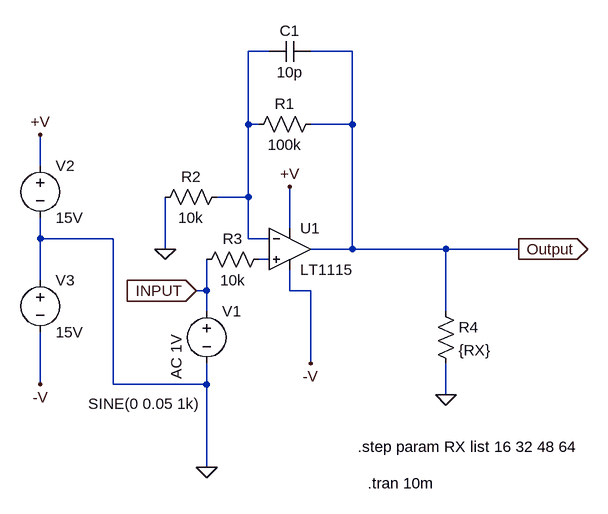
[diagram p0: schematic 25.1_11.(1).asc]
25.1_11.(1).asc, the LTspice schematic file:
Version 4
SHEET 1 880 680
WIRE 192 -112 160 -112
WIRE 320 -112 256 -112
WIRE 160 0 160 -112
WIRE 176 0 160 0
WIRE 320 0 320 -112
WIRE 320 0 256 0
WIRE -160 64 -160 16
WIRE 160 112 160 0
WIRE 160 112 112 112
WIRE 224 160 224 96
WIRE -160 176 -160 144
WIRE -48 176 -160 176
WIRE 160 176 160 112
WIRE 192 176 160 176
WIRE 32 192 32 112
WIRE 320 192 320 0
WIRE 320 192 256 192
WIRE 464 192 320 192
WIRE 576 192 464 192
WIRE 192 208 176 208
WIRE -160 240 -160 176
WIRE 96 256 96 208
WIRE 96 256 80 256
WIRE 224 256 224 224
WIRE 256 256 224 256
WIRE 96 288 96 256
WIRE 464 288 464 192
WIRE 256 368 256 256
WIRE -160 400 -160 320
WIRE -48 400 -48 176
WIRE 96 400 96 368
WIRE 96 400 -48 400
WIRE 464 416 464 368
WIRE 96 528 96 400
FLAG 576 192 Output
IOPIN 576 192 Out
FLAG 96 528 0
FLAG -160 16 +V
FLAG 224 96 +V
FLAG -160 400 -V
FLAG 256 368 -V
FLAG 80 256 INPUT
IOPIN 80 256 In
FLAG 464 416 0
FLAG 32 192 0
SYMBOL voltage -160 48 R0
WINDOW 123 0 0 Left 2
WINDOW 39 0 0 Left 2
SYMATTR InstName V2
SYMATTR Value 15V
SYMBOL voltage -160 224 R0
WINDOW 123 0 0 Left 2
WINDOW 39 0 0 Left 2
SYMATTR InstName V3
SYMATTR Value 15V
SYMBOL voltage 96 272 R0
WINDOW 123 -47 121 VLeft 2
WINDOW 39 0 0 Left 2
WINDOW 3 -182 158 Left 2
SYMATTR Value2 AC 1V
SYMATTR Value SINE(0 0.05 1k)
SYMATTR InstName V1
SYMBOL res 128 96 R90
WINDOW 0 0 56 VBottom 2
WINDOW 3 32 56 VTop 2
SYMATTR InstName R2
SYMATTR Value 10k
SYMBOL res 192 192 R90
WINDOW 0 0 56 VBottom 2
WINDOW 3 32 56 VTop 2
SYMATTR InstName R3
SYMATTR Value 10k
SYMBOL res 272 -16 R90
WINDOW 0 0 56 VBottom 2
WINDOW 3 32 56 VTop 2
SYMATTR InstName R1
SYMATTR Value 100k
SYMBOL res 448 272 R0
SYMATTR InstName R4
SYMATTR Value {RX}
SYMBOL Opamps\\LT1115 224 128 R0
SYMATTR InstName U1
SYMBOL cap 256 -128 R90
WINDOW 0 0 32 VBottom 2
WINDOW 3 32 32 VTop 2
SYMATTR InstName C1
SYMATTR Value 10p
TEXT 328 496 Left 2 !.step param RX list 16 32 48 64
TEXT 344 552 Left 2 !.tran 10m

The netlist it stands for:
* 25.1_11.(1).asc
V2 +V 0 15V
V3 0 -V 15V
V1 INPUT 0 SINE(0 0.05 1k) AC 1V
R2 N001 0 10k
R3 N002 INPUT 10k
R1 Output N001 100k
R4 Output 0 {RX}
XU1 N002 N001 +V -V Output LT1028  ; LT1115, pins In+ In- V+ V- OUT
C1 Output N001 10p
.step param RX list 16 32 48 64
.tran 10m
.lib LTC.lib
.backanno
.end

* Results of the author's LTspice run, read from the files saved beside the schematic
* Operating Point (first step), zero values left out:
*   rx = 16 
*   V(+v) = 15 V
*   V(-v) = -15 V
*   I(V3) = -7.4 mA
*   I(V2) = -7.4 mA
*   Ix(u1:3) = 7.4 mA
*   Ix(u1:4) = -7.4 mA
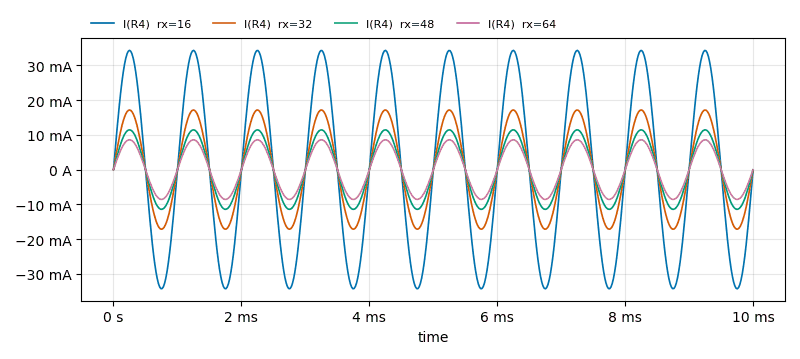
[diagram p1: Transient Analysis of 25.1_11.(1).asc, plotted from the saved traces]
* Transient Analysis, 4 runs:
*   I(R4) [rx=16]: min -34.33 mA, max 34.34 mA, average 52.27 nA, rms 24.28 mA, last -245.5 µA
*   I(R4) [rx=32]: min -17.17 mA, max 17.17 mA, average 14.53 nA, rms 12.14 mA, last -113.1 µA
*   I(R4) [rx=48]: min -11.45 mA, max 11.45 mA, average 9.196 nA, rms 8.092 mA, last -73.38 µA
*   I(R4) [rx=64]: min -8.584 mA, max 8.584 mA, average 6.292 nA, rms 6.069 mA, last -54.29 µA